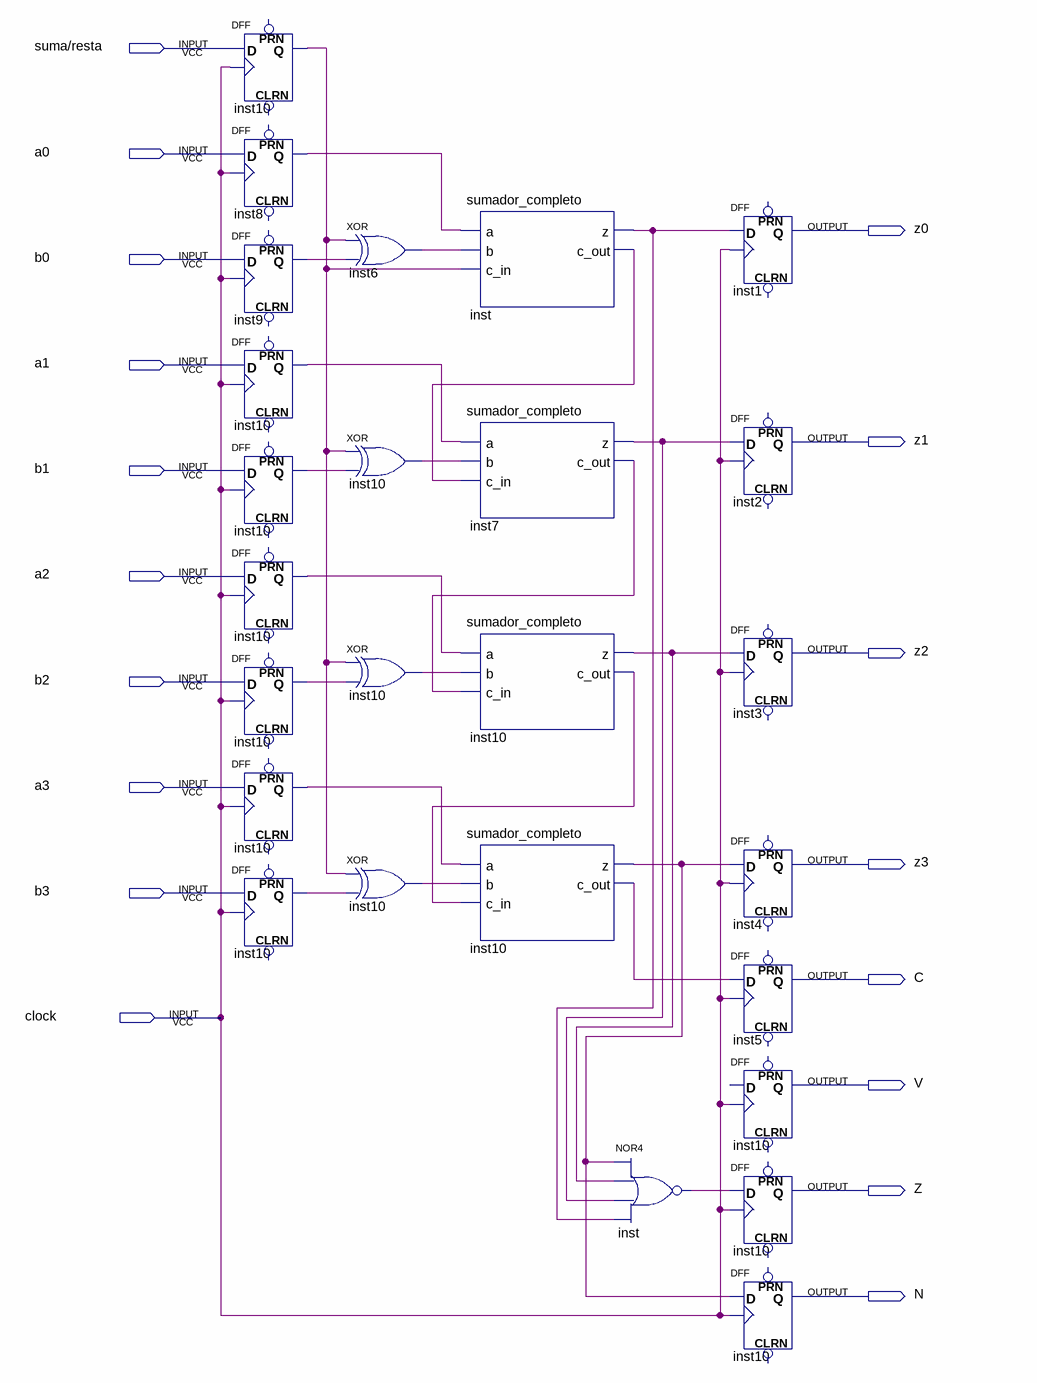
[diagram p0: schematic sheet]
// Quartus schematic Sumador-restador.bdf as structural Verilog: 26 symbols, 18 pins
module \Sumador-restador  (
  input  \suma/resta ,
  input  a0,
  input  b0,
  input  a1,
  input  b1,
  input  a2,
  input  b2,
  input  a3,
  input  b3,
  input  clock,
  output z0,
  output z1,
  output z2,
  output z3,
  output C,
  output V,
  output Z,
  output N
);

  wire inst6_out, inst7_c_out, inst7_z, inst8_q, inst9_q, inst10_c_out, inst10_c_out_2, inst10_out,
       inst10_out_2, inst10_out_3, inst10_q, inst10_q_2, inst10_q_3, inst10_q_4, inst10_q_5, inst10_q_6,
       inst10_q_7, inst10_z, inst10_z_2, inst_c_out, inst_out, inst_z;

  DFF inst10 (.CLK(clock), .D(\suma/resta ), .Q(inst10_q_6));  // open: CLRN, PRN
  DFF inst8 (.CLK(clock), .D(a0), .Q(inst8_q));  // open: CLRN, PRN
  DFF inst9 (.CLK(clock), .D(b0), .Q(inst9_q));  // open: CLRN, PRN
  DFF inst10_dup2 (.CLK(clock), .D(a1), .Q(inst10_q_2));  // open: CLRN, PRN
  DFF inst10_dup3 (.CLK(clock), .D(b1), .Q(inst10_q));  // open: CLRN, PRN
  DFF inst10_dup4 (.CLK(clock), .D(a2), .Q(inst10_q_4));  // open: CLRN, PRN
  DFF inst10_dup5 (.CLK(clock), .D(b2), .Q(inst10_q_3));  // open: CLRN, PRN
  DFF inst10_dup6 (.CLK(clock), .D(a3), .Q(inst10_q_7));  // open: CLRN, PRN
  DFF inst10_dup7 (.CLK(clock), .D(b3), .Q(inst10_q_5));  // open: CLRN, PRN
  xor inst6 (inst6_out, inst10_q_6, inst9_q);
  xor inst10_dup8 (inst10_out, inst10_q_6, inst10_q);
  xor inst10_dup9 (inst10_out_2, inst10_q_6, inst10_q_3);
  xor inst10_dup10 (inst10_out_3, inst10_q_6, inst10_q_5);
  sumador_completo inst (.a(inst8_q), .b(inst6_out), .c_in(inst10_q_6), .z(inst_z), .c_out(inst_c_out));
  sumador_completo inst7 (.a(inst10_q_2), .b(inst10_out), .c_in(inst_c_out), .z(inst7_z), .c_out(inst7_c_out));
  sumador_completo inst10_dup11 (
    .a(inst10_q_4), .b(inst10_out_2), .c_in(inst7_c_out), .z(inst10_z), .c_out(inst10_c_out));
  sumador_completo inst10_dup12 (
    .a(inst10_q_7), .b(inst10_out_3), .c_in(inst10_c_out), .z(inst10_z_2), .c_out(inst10_c_out_2));
  nor inst_dup2 (inst_out, inst10_z_2, inst10_z, inst7_z, inst_z);
  DFF inst1 (.CLK(clock), .D(inst_z), .Q(z0));  // open: CLRN, PRN
  DFF inst2 (.CLK(clock), .D(inst7_z), .Q(z1));  // open: CLRN, PRN
  DFF inst3 (.CLK(clock), .D(inst10_z), .Q(z2));  // open: CLRN, PRN
  DFF inst4 (.CLK(clock), .D(inst10_z_2), .Q(z3));  // open: CLRN, PRN
  DFF inst5 (.CLK(clock), .D(inst10_c_out_2), .Q(C));  // open: CLRN, PRN
  DFF inst10_dup13 (.CLK(clock), .Q(V));  // open: CLRN, D, PRN
  DFF inst10_dup14 (.CLK(clock), .D(inst_out), .Q(Z));  // open: CLRN, PRN
  DFF inst10_dup15 (.CLK(clock), .D(inst10_z_2), .Q(N));  // open: CLRN, PRN
endmodule
